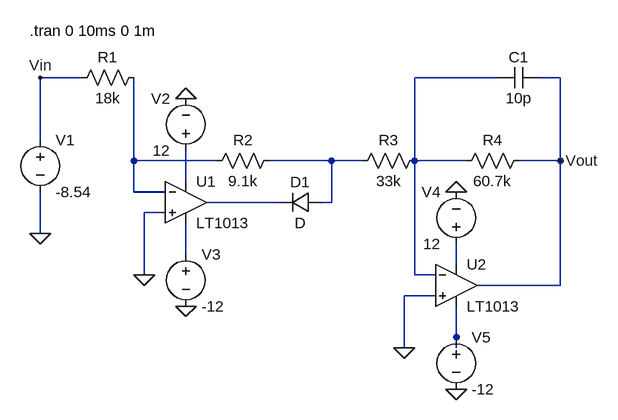
[diagram p0: schematic absolute_value Circuit.asc]
absolute_value Circuit.asc, the LTspice schematic file:
Version 4.1
SHEET 1 1124 708
WIRE 208 208 144 208
WIRE 848 208 720 208
WIRE 944 208 912 208
WIRE 144 304 144 208
WIRE 288 336 288 208
WIRE 416 336 288 336
WIRE 592 336 496 336
WIRE 640 336 592 336
WIRE 720 336 720 208
WIRE 800 336 720 336
WIRE 944 336 944 208
WIRE 944 336 880 336
WIRE 368 368 368 320
WIRE 288 384 288 336
WIRE 336 384 288 384
WIRE 512 400 400 400
WIRE 592 400 592 336
WIRE 592 400 576 400
WIRE 336 416 304 416
WIRE 144 448 144 384
WIRE 368 480 368 432
WIRE 784 496 784 464
WIRE 304 512 304 416
WIRE 720 512 720 336
WIRE 752 512 720 512
WIRE 944 528 944 336
WIRE 944 528 816 528
WIRE 752 544 704 544
WIRE 784 608 784 560
WIRE 704 624 704 544
WIRE 784 624 784 608
FLAG 144 448 0
FLAG 304 512 0
FLAG 368 240 0
FLAG 368 560 0
FLAG 704 624 0
FLAG 784 384 0
FLAG 784 688 0
FLAG 944 336 Vout
FLAG 144 208 Vin
DATAFLAG 944 336 ""
DATAFLAG 944 336 ""
DATAFLAG 944 336 ""
SYMBOL OpAmps/LT1013 368 336 R0
SYMATTR InstName U1
SYMBOL Res 304 192 R90
WINDOW 0 0 56 VBottom 2
WINDOW 3 32 56 VTop 2
SYMATTR InstName R1
SYMATTR Value 18k
SYMBOL Voltage 144 288 R0
WINDOW 123 0 0 Left 0
WINDOW 39 0 0 Left 0
SYMATTR InstName V1
SYMATTR Value -8.54
SYMBOL Voltage 368 336 R180
WINDOW 0 24 96 Left 2
WINDOW 3 24 16 Left 2
SYMATTR InstName V2
SYMATTR Value 12
SYMBOL Voltage 368 464 R0
SYMATTR InstName V3
SYMATTR Value -12
SYMBOL Res 512 320 R90
WINDOW 0 0 56 VBottom 2
WINDOW 3 32 56 VTop 2
SYMATTR InstName R2
SYMATTR Value 9.1k
SYMBOL Res 736 320 R90
WINDOW 0 0 56 VBottom 2
WINDOW 3 32 56 VTop 2
SYMATTR InstName R3
SYMATTR Value 33k
SYMBOL Cap 912 192 R90
WINDOW 0 0 32 VBottom 2
WINDOW 3 32 32 VTop 2
SYMATTR InstName C1
SYMATTR Value 10p
SYMBOL Res 896 320 R90
WINDOW 0 0 56 VBottom 2
WINDOW 3 32 56 VTop 2
SYMATTR InstName R4
SYMATTR Value 60.7k
SYMBOL OpAmps/LT1013 784 464 R0
SYMATTR InstName U2
SYMBOL Voltage 784 480 R180
WINDOW 0 24 96 Left 2
WINDOW 3 24 16 Left 2
SYMATTR InstName V4
SYMATTR Value 12
SYMBOL Voltage 784 592 R0
SYMATTR InstName V5
SYMATTR Value -12
SYMBOL Diode 576 384 R90
WINDOW 0 0 32 VBottom 2
WINDOW 3 32 32 VTop 2
SYMATTR InstName D1
TEXT 128 136 Left 2 !.tran 0 10ms 0 1m

The netlist it stands for:
* absolute_value Circuit.asc
X§U1 0 N002 N004 N006 N005 LT1013  ; pins In+ In- V+ V- OUT
R1 N002 Vin 18k
V1 Vin 0 -8.54
V2 N004 0 12
V3 N006 0 -12
R2 N003 N002 9.1k
R3 N001 N003 33k
C1 Vout N001 10p
R4 Vout N001 60.7k
X§U2 0 N001 N007 N008 Vout LT1013  ; pins In+ In- V+ V- OUT
V4 N007 0 12
V5 N008 0 -12
D1 N003 N005 D
.model D D
.lib standard.dio
.tran 0 10ms 0 1m
.lib LTC.lib
.backanno
.end